# Altium project josh's secret project.PrjPcb
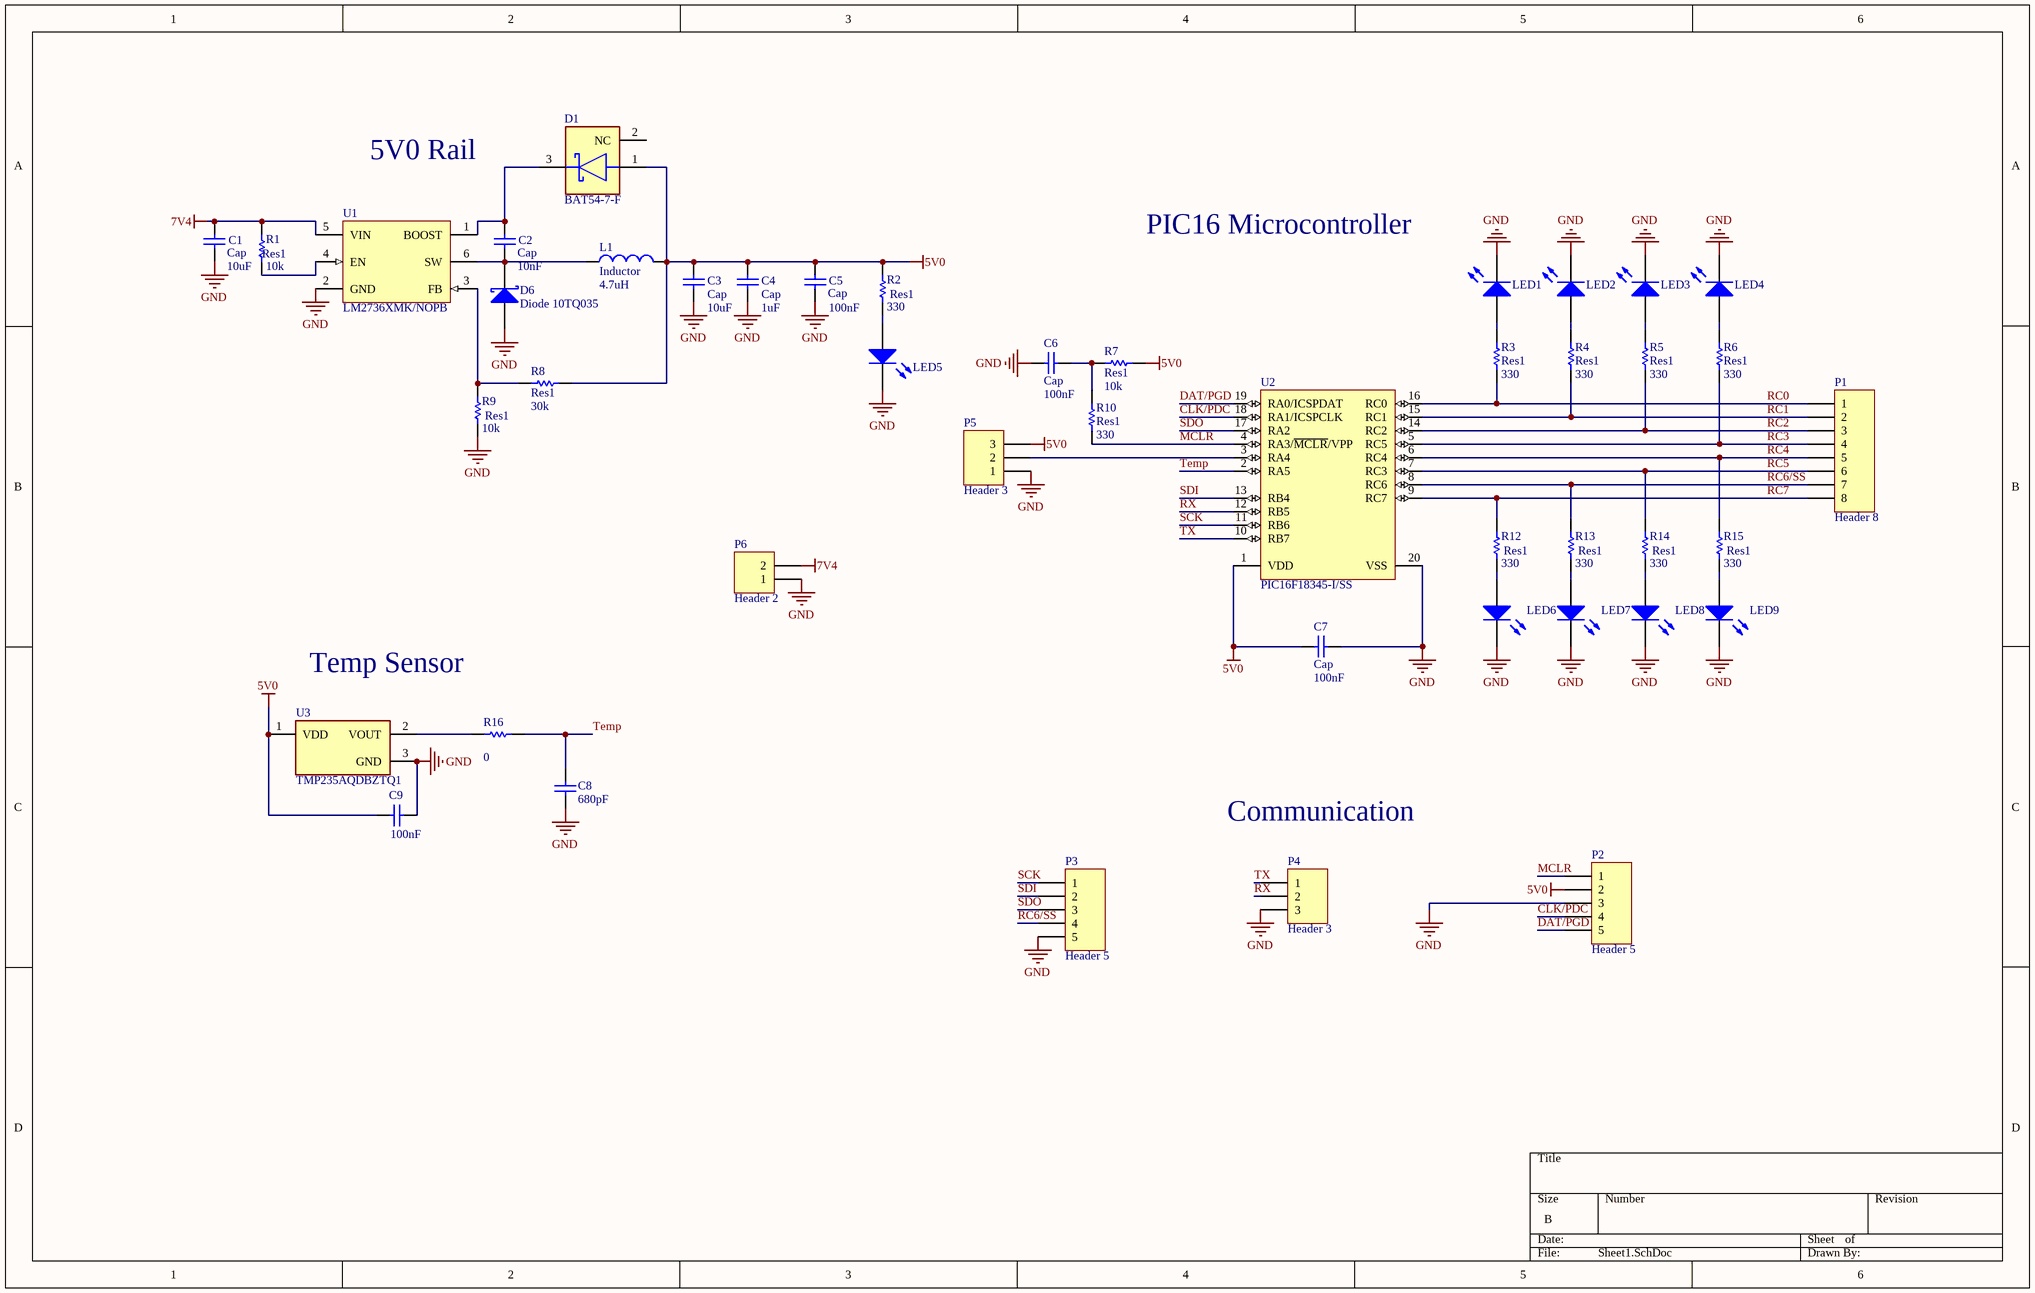
[diagram p0: Sheet1.SchDoc]
1 sheet, 45 parts. Net scope: global (net labels, ports and power ports of the same name join across sheets).
Board file: PCB2.PcbDoc

## Sheet Sheet1.SchDoc
size B

### Parts
C1  Cap  value 10uF  [6-0805_M]
C2  Cap  value 10nF  [6-0805_M]
C3  Cap  value 10uF  [6-0805_M]
C4  Cap  value 1uF  [6-0805_M]
C5  Cap  value 100nF  [6-0805_M]
C6  Cap  value 100nF  [6-0805_M]
C7  Cap  value 100nF  [6-0805_M]
C8  value 680pF  [6-0805_M]  (hidden comment: Cap)
C9  value 100nF  [6-0805_M]  (hidden comment: Cap)
D1  BAT54-7-F  [FP-SOT23-MFG]
D6  Diode 10TQ035  [CDBA5]
L1  Inductor  value 4.7uH  [INDC2520X100N]
LED1  150080BS75000  [0805_A]  (value not drawn)
LED2  150080BS75000  [0805_A]  (value not drawn)
LED3  150080BS75000  [0805_A]  (value not drawn)
LED4  150080BS75000  [0805_A]  (value not drawn)
LED5  150080BS75000  [0805_A]  (value not drawn)
LED6  150080BS75000  [0805_A]  (value not drawn)
LED7  150080BS75000  [0805_A]  (value not drawn)
LED8  150080BS75000  [0805_A]  (value not drawn)
LED9  150080BS75000  [0805_A]  (value not drawn)
P1  Header 8  [HDR1X8]
P2  Header 5  [HDR1X5]
P3  Header 5  [HDR1X5]
P4  Header 3  [HDR1X3]
P5  Header 3  [HDR1X3]
P6  Header 2  [HDR1X2]
R1  Res1  value 10k  [6-0805_M]
R2  Res1  value 330  [6-0805_M]
R3  Res1  value 330  [6-0805_M]
R4  Res1  value 330  [6-0805_M]
R5  Res1  value 330  [6-0805_M]
R6  Res1  value 330  [6-0805_M]
R7  Res1  value 10k  [6-0805_M]
R8  Res1  value 30k  [6-0805_M]
R9  Res1  value 10k  [6-0805_M]
R10  Res1  value 330  [6-0805_M]
R12  Res1  value 330  [6-0805_M]
R13  Res1  value 330  [6-0805_M]
R14  Res1  value 330  [6-0805_M]
R15  Res1  value 330  [6-0805_M]
R16  value 0  [6-0805_M]  (hidden comment: Res1)
U1  LM2736XMK/NOPB  [DDC0006A_L]
U2  PIC16F18345-I/SS  [MCHP-SS-20_V]
U3  TMP235AQDBZTQ1  [FP-DBZ0003A-MFG]

### Nets
5V0: C3.2 C4.2 C5.2 C7.2 C9.1 D1.1(A) L1.2 P2.2 P5.3 R2.2 R7.2 R8.1 U2.1(VDD) U3.1(VDD)
7V4: C1.2 P6.2 R1.2 U1.5(VIN)
GND: C1.1 C3.1 C4.1 C5.1 C6.2 C7.1 C8.2 C9.2 D6.3(A) LED1.1(K) LED2.1(K) LED3.1(K) LED4.1(K) LED5.1(K) LED6.1(K) LED7.1(K) LED8.1(K) LED9.1(K) P2.3 P3.5 P4.3 P5.1 P6.1 R9.1 U1.2(GND) U2.20(VSS) U3.3(GND)
CLK/PDC: P2.4 U2.18(RA1/ICSPCLK)
DAT/PGD: P2.5 U2.19(RA0/ICSPDAT)
MCLR: P2.1 R10.1 U2.4(RA3/~{MCLR}/VPP)
RC0: P1.1 R3.2 U2.16(RC0)
RC1: P1.2 R4.2 U2.15(RC1)
RC2: P1.3 R5.2 U2.14(RC2)
RC3: P1.4 R6.2 U2.5(RC5)
RC4: P1.5 R15.2 U2.6(RC4)
RC5: P1.6 R14.2 U2.7(RC3)
RC6/SS: P1.7 P3.4 R13.2 U2.8(RC6)
RC7: P1.8 R12.2 U2.9(RC7)
RX: P4.2 U2.12(RB5)
SCK: P3.1 U2.11(RB6)
SDI: P3.2 U2.13(RB4)
SDO: P3.3 U2.17(RA2)
Temp: C8.1 R16.2 U2.2(RA5)
TX: P4.1 U2.10(RB7)
NetC2_1: C2.1 D6.1(K) L1.1 U1.6(SW)
NetC2_2: C2.2 D1.3(C) U1.1(BOOST)
NetC6_1: C6.1 R7.1 R10.2
NetLED1_2: LED1.2(A) R3.1
NetLED2_2: LED2.2(A) R4.1
NetLED3_2: LED3.2(A) R5.1
NetLED4_2: LED4.2(A) R6.1
NetLED5_2: LED5.2(A) R2.1
NetLED6_2: LED6.2(A) R12.1
NetLED7_2: LED7.2(A) R13.1
NetLED8_2: LED8.2(A) R14.1
NetLED9_2: LED9.2(A) R15.1
NetP5_2: P5.2 U2.3(RA4)
NetR1_1: R1.1 U1.4(EN)
NetR8_2: R8.2 R9.2 U1.3(FB)
NetR16_1: R16.1 U3.2(VOUT)

Not connected (* = marked no-connect by the designer): D1 2(NC)

### Notes on the sheet
- 5V0 Rail
- PIC16 Microcontroller
- Temp Sensor
- Communication

### Library data of the parts
C1-C9 = Cap: Capacitor; Published: 8-Jun-2000; LatestRevisionDate: 17-Jul-2002; LatestRevisionNote: Re-released for DXP Platform.; PackageReference: RAD-0.3; Publisher: Altium Limited; PackageDescription: Radial Cap, Thru-Hole; 2 Leads; 0.3 in Pin Spacing
D1 = CMP-0303-00002-2: DIODE SCHOTTKY 30V 200MA SOT23-3; Manufacturer: Diodes Inc.; Value: 10pF; Automotive Grade: NA; Max Junction Temp: +150°C; Peak Reverse Current: 2uA; Max Surge Forward Current: 600mA; Standoff Height: 0.013mm; Max Repetitive Reverse Voltage: 30V; Automotive: No; Package: SOT23; Category: Diode; Digikey Description: DIODE SCHOTTKY 30V 200MA SOT23-3; RoHS: TRUE; Temperature Range Low: -65°C; Device Class L3: Schottky Diodes; Footprint Url: https://www.diodes.com/assets/Package-Files/SOT23.pdf; Forward Current: 200mA; Reverse Voltage: 30V; Manufacturer Part Number: BAT54-7-F; Octopart: https://octopart.com/bat54-7-f-diodes+inc.-39681803; Lead Free: Yes; Temperature Range High: +150°C; ComponentLink2Description: Datasheet; Height: 1.1mm; Capacitance: 10pF; ComponentLink2URL: https://www.diodes.com/assets/Datasheets/ds11005.pdf; Temperature: -65°C to +150°C; Device Class L1: Discrete Semiconductors; Device Class L2: Diodes; Mouser Description: Switching diode SOT-23 30 V 200 mA
D6 = Diode 10TQ035: Schottky Rectifier; Note: Terminal 2 is the TAB and is electrically connected to the cathode; Published: 8-Jun-2000; LatestRevisionDate: 17-Jul-2002; LatestRevisionNote: Re-released for DXP Platform.; DatasheetVersion: PD-2.057B; PackageVersion: Feb-1998; PackageReference: TO-220AC; Publisher: Altium Limited; PackageDescription: TO, Thru-Hole, Vertical, Heatsink Mounted; 3 In-Line Leads (1 Absent); Pitch 2.54 mm; ComponentLink1Description: Manufacturer Link; ComponentLink1URL: http://www.irf.com/; ComponentLink2Description: Datasheet; ComponentLink2URL: http://www.irf.com/product-info/datasheets/data/10tq.pdf
L1 = Inductor: Code_IEC: 1005; Published: 8-Jun-2000; LatestRevisionDate: 29-May-2009; LatestRevisionNote: IPC-7351 Footprint Added.; PackageReference: 0402-A; Publisher: Altium Limited; PackageDescription: Chip Inductor; Code_JEITA: 0402
LED1-LED9 = CMP-1426-00008-1: SMD mono-color Chip LED, WL-SMCW, Blue; Manufacturer: Wuerth Elektronik; Color: Blue; ComponentLink2URL: http://katalog.we-online.com/led/datasheet/150080BS75000.pdf; ComponentLink1URL: http://www.we-online.com; ComponentLink2Description: Datasheet; PackageReference: 0805_A; ComponentLink1Description: Manufacturer URL; PartNumber: 150080BS75000
P1 = Header 8: Header, 8-Pin; LatestRevisionDate: 17-Jul-2002; LatestRevisionNote: Re-released for DXP Platform.; Publisher: Altium Limited
P2 P3 = Header 5: Header, 5-Pin; LatestRevisionDate: 17-Jul-2002; LatestRevisionNote: Re-released for DXP Platform.; Publisher: Altium Limited
P4 P5 = Header 3: Header, 3-Pin; LatestRevisionDate: 17-Jul-2002; LatestRevisionNote: Re-released for DXP Platform.; Publisher: Altium Limited
P6 = Header 2: Header, 2-Pin; LatestRevisionDate: 17-Jul-2002; LatestRevisionNote: Re-released for DXP Platform.; Publisher: Altium Limited
R1-R10 R12-R16 = Res1: Resistor; Published: 8-Jun-2000; LatestRevisionDate: 17-Jul-2002; LatestRevisionNote: Re-released for DXP Platform.; PackageReference: AXIAL-0.3; Publisher: Altium Limited; PackageDescription: Axial Device, Thru-Hole; 2 Leads; 0.3 in Pin Spacing
U1 = CMP-0069-01211-3: 750mA Load Step-Down DC-DC Regulator, 6-pin Tiny SOT23, Pb-Free; Manufacturer: Texas Instruments; PowerWise: N; CompType: Switcher; PackageTopMarking: SHAB*XTT; Code_IPC: SOT26A-6; PackageDescription: Molded TSOT, 2.97 x 1.65 x 0.87mm Body, 6 Lead, 0.95mm Pitch; ComponentLink1Description: Datasheet URL; RoHS: Y; ComponentLink1URL: http://www.ti.com/general/docs/lit/getliterature.tsp?genericPartNumber=LM2736&fileType=pdf; PinCount: 6; PackageReference: DDC0006A; Code_JEDEC: MO-193-AA
U2 = CMP-2000-06894-1: Full-Featured, Low Pin Count Microcontrollers with XLP, 8 Bit, 14 KB, 1024 RAM, 1.8 to 5.5 V, -40 to 85 degC, 20-Pin SSOP (SS), RoHS, Tube; Manufacturer: Microchip-Technology; Program Memory Type: FLASH; EEPROM Size: 256x8; Core Processor: PIC; Voltage - Supply (Vcc/Vdd): 2.3V~5.5V; Data Converters: A/D17x10b,D/A1x5b; Oscillator Type: Internal; RAM Size: 1Kx8; Peripherals: Brown-outDetect/Reset,POR,PWM,WDT; Program Memory Size: 14KB(8Kx14); Core Size: 8-Bit; Speed: 32MHz; Number of I/O: 18; Connectivity: I²C,LIN,SPI,UART/USART; Packaging: Tube; Datasheet Version: Rev. C, 10/2016; Operating Temperature: -40°C~85°C(TA); Package / Case: 20-SSOP(0.209",5.30mmWidth); Manufacturer URL: http://www.microchip.com/; Family: Embedded-Microcontrollers; Mounting Technology: SurfaceMount; Datasheet URL: http://ww1.microchip.com/downloads/en/DeviceDoc/40001795C.pdf; Supplier Device Package: 20-SSOP; Package Reference: SS-20; Package Description: 20-Pin Shrink Small Outline Package Integrated Circuit, Body 7.2 x 5.3 mm, Pitch 0.65 mm; Package URL: http://ww1.microchip.com/downloads/en/PackagingSpec/00000049CE.pdf; Series: PIC®XLP™16F; Category: IntegratedCircuits(ICs)
U3 = CMP-04948-000003-1: LOW-POWER HIGH-ACCURACY ANALOG O; Manufacturer: Texas Instruments; Manufacturer Part Number: TMP235A2DBZR; Output Current: 500uA; Operating Supply Current: 9uA; Max Supply Voltage: 5.5V; Max Junction Temp: +150°C; Accuracy: 0.5%; Min Supply Voltage: 2.3V; Standoff Height: 0.01mm; Sensor Output: Analog Voltage; Ambient Temperature Range Low: -40°C; Device Class L2: Temperature and Humidity Sensors; Digikey Description: LOW-POWER HIGH-ACCURACY ANALOG O; Lead Free: Yes; Category: IC; Device Class L3: unset; Temperature Range Low: -40°C; ComponentLink2Description: Datasheet; Package: DBZ0003A; Octopart: https://octopart.com/tmp235a2dbzr-texas+instruments-94966376; Device Class L1: Sensors; Temperature Range High: +150°C; Height: 1.12mm; Temperature: -40°C to +150°C; RoHS: TRUE; Ambient Temperature Range High: +150°C; Automotive: No; ComponentLink2URL: http://www.ti.com/lit/ds/symlink/tmp235.pdf; Mouser Description: ±2°C Analog output temperature sensor, with 10mV /°C gain 3-SOT-23 -40 to 150